# Altium schematic sheet DRV8711MOD.SchDoc
size A4
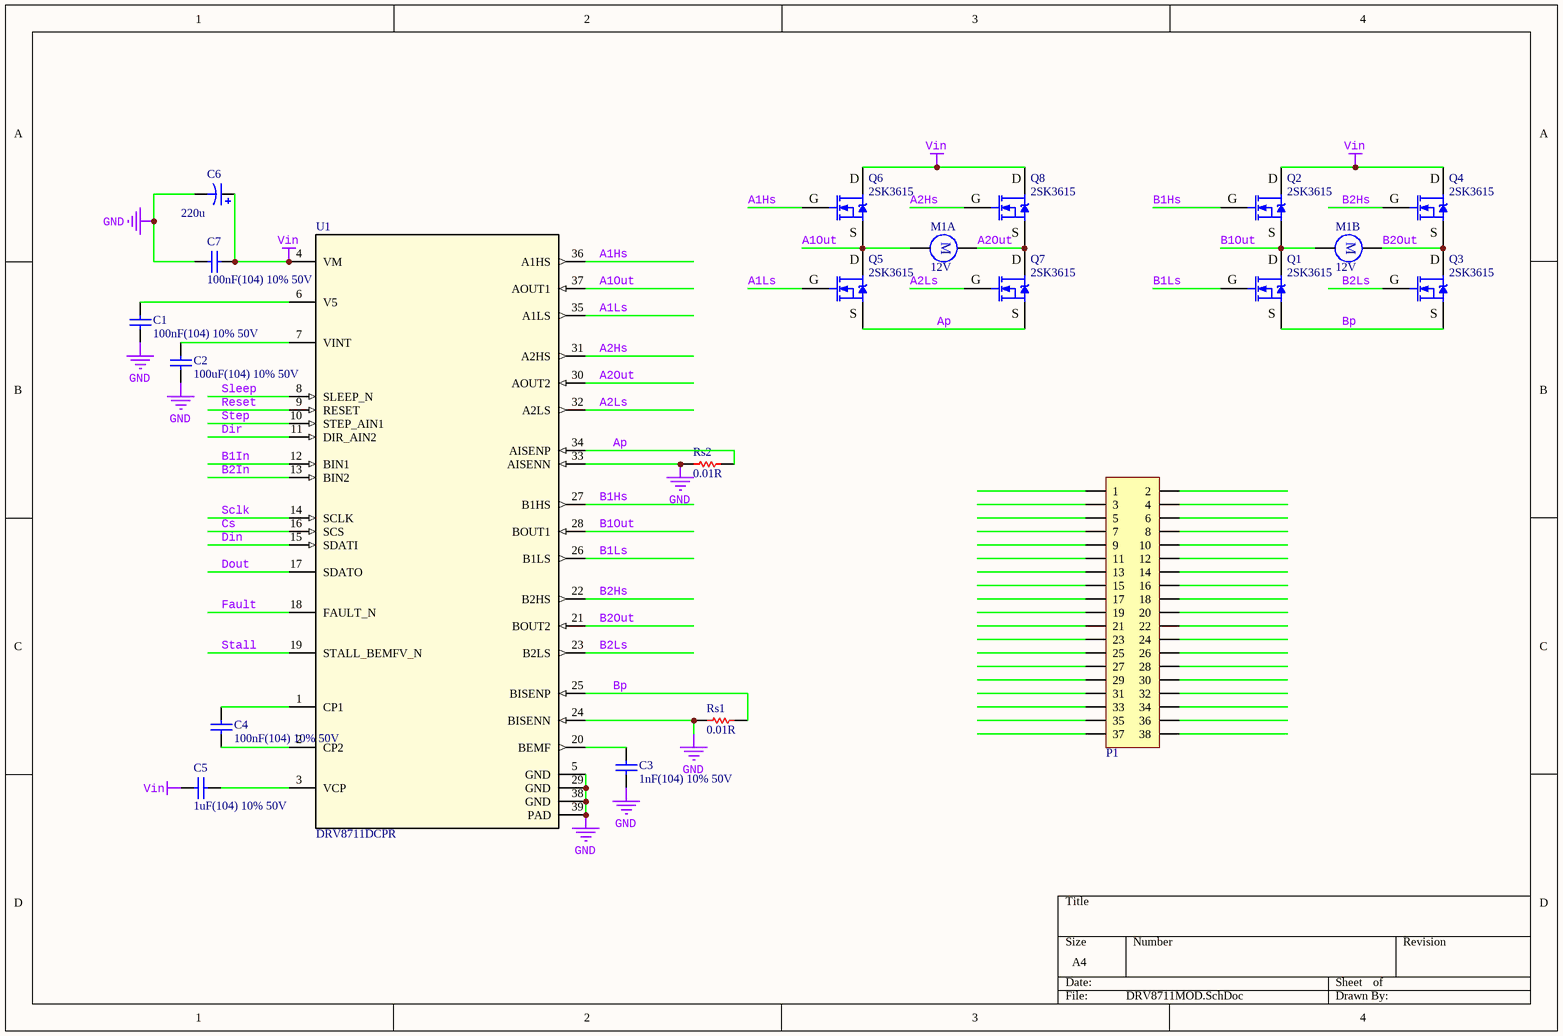
[diagram p0: DRV8711MOD.SchDoc]

## Parts
C1  100nF(104) 10% 50V  [0603_C]
C2  100uF(104) 10% 50V  [0603_C]
C3  1nF(104) 10% 50V  [0603_C]
C4  100nF(104) 10% 50V  [0603_C]
C5  1uF(104) 10% 50V  [0603_C]
C6  220u  [CM F(10*10.2)]
C7  100nF(104) 10% 50V  [0603_C]
M1  12V  [MotorStep]  (parts A,B of 2)
P1  Header 2X11  [TB2.54 19x2]  (value not drawn)
Q1  2SK3615  [IRF3205]
Q2  2SK3615  [IRF3205]
Q3  2SK3615  [IRF3205]
Q4  2SK3615  [IRF3205]
Q5  2SK3615  [IRF3205]
Q6  2SK3615  [IRF3205]
Q7  2SK3615  [IRF3205]
Q8  2SK3615  [IRF3205]
Rs1  0.01R  [R 2512_L]
Rs2  0.01R  [R 2512_L]
U1  DRV8711DCPR  [DCP0038A_L]

## Nets
GND: C1.1 C2.1 C3.1 C6.2 C7.2 Rs1.1 Rs2.1 U1.5(GND) U1.24(BISENN) U1.29(GND) U1.33(AISENN) U1.38(GND) U1.39(PAD)
Vin: C5.2 C6.1 C7.1 Q2.2(D) Q4.2(D) Q6.2(D) Q8.2(D) U1.4(VM)
A1Hs: Q6.1(G) U1.36(A1HS)
A1Ls: Q5.1(G) U1.35(A1LS)
A1Out: M1.2 Q5.2(D) Q6.3(S) U1.37(AOUT1)
A2Hs: Q8.1(G) U1.31(A2HS)
A2Ls: Q7.1(G) U1.32(A2LS)
A2Out: M1.1 Q7.2(D) Q8.3(S) U1.30(AOUT2)
Ap: Q5.3(S) Q7.3(S) Rs2.2 U1.34(AISENP)
B1Hs: Q2.1(G) U1.27(B1HS)
B1In: U1.12(BIN1)
B1Ls: Q1.1(G) U1.26(B1LS)
B1Out: M1.4 Q1.2(D) Q2.3(S) U1.28(BOUT1)
B2Hs: Q4.1(G) U1.22(B2HS)
B2In: U1.13(BIN2)
B2Ls: Q3.1(G) U1.23(B2LS)
B2Out: M1.3 Q3.2(D) Q4.3(S) U1.21(BOUT2)
Bp: Q1.3(S) Q3.3(S) Rs1.2 U1.25(BISENP)
Cs: U1.16(SCS)
Din: U1.15(SDATI)
Dir: U1.11(DIR_AIN2)
Dout: U1.17(SDATO)
Fault: U1.18(FAULT_N)
Reset: U1.9(RESET)
Sclk: U1.14(SCLK)
Sleep: U1.8(SLEEP_N)
Stall: U1.19(STALL_BEMFV_N)
Step: U1.10(STEP_AIN1)
NetC1_2: C1.2 U1.6(V5)
NetC2_2: C2.2 U1.7(VINT)
NetC3_2: C3.2 U1.20(BEMF)
NetC4_1: C4.1 U1.2(CP2)
NetC4_2: C4.2 U1.1(CP1)
NetC5_1: C5.1 U1.3(VCP)

Not connected (* = marked no-connect by the designer): P1 1 2 3 4 5 6 7 8 9 10 11 12 13 14 15 16 17 18 19 20 21 22 23 24 25 26 27 28 29 30 31 32 33 34 35 36 37 38

## Notes on the sheet
- (in symbol MotorStep, part A) M
- (in symbol MotorStep, part B) M

## Library data of the parts
C1-C5 C7 = 0805 100nF(104) 10% 50V: 贴片电容; ComponentLink1Description: 供应商链接; ComponentLink1URL: http://www.szlcsc.com/product/details_50686.html; Package: 0805; Supplier: LC; SuppliersPartNumber: C49678
C6 = Cp: Polarized Capacitor (Axial); Published: 8-Jun-2000; LatestRevisionDate: 17-Jul-2002; LatestRevisionNote: Re-released for DXP Platform.; PackageReference: POLAR0.8; Publisher: Altium Limited; PackageDescription: Polarized Capacitor; 2 Leads
M1 = MotorStep: 直流电机; 版权归属: 源创客; BOM名称: 直流电机; 学习资源: www.ooocke.com
P1 = Header 19X2: 19*2P接插件; 版权归属: 源创客; BOM名称: 19*2P接插件; 学习资源: www.ooocke.com
Q1-Q8 = NMOS: N沟场效应管; 版权归属: 源创客; BOM名称: N沟场效应管; 学习资源: www.ooocke.com
Rs1 Rs2 = Rs
U1 = DRV8711DCPR: Imported; Manufacturer: Texas Instruments; PartNumber: DRV8711DCPR; RefDes: RefDes; TYPE: TYPE; Value: Value